# Altium schematic sheet Ext_PTT_and_Indication.SchDoc
size A3
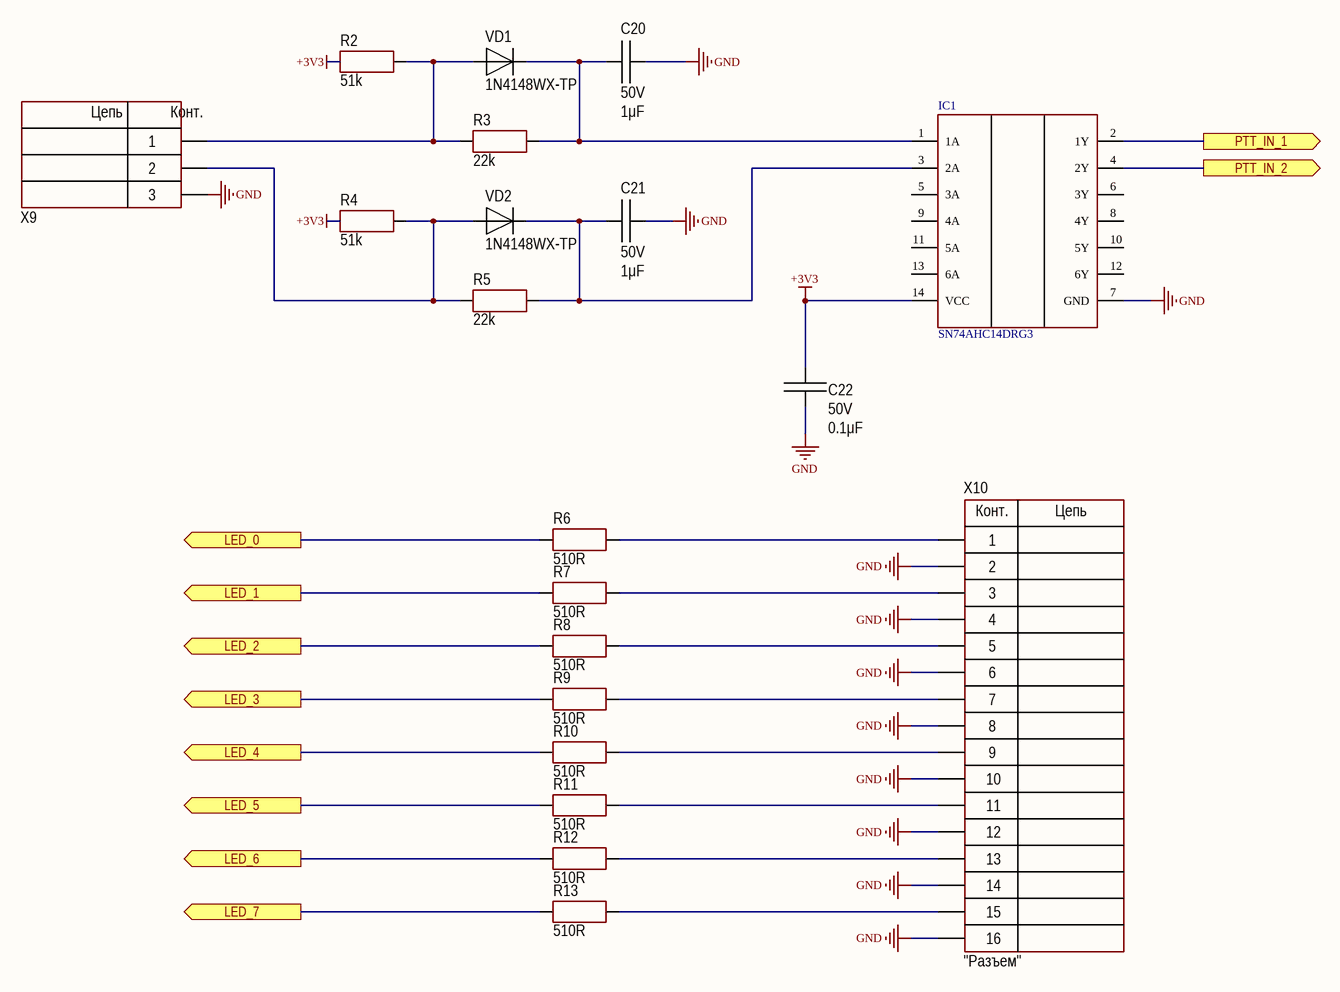
[diagram p0: Ext_PTT_and_Indication.SchDoc]

## Parts
C20  value 1μF  Voltage: 50V  [CAP: 1206]
C21  value 1μF  Voltage: 50V  [CAP: 1206]
C22  value 0.1μF  Voltage: 50V  [CAP: 1206]
IC1  SN74AHC14DRG3  [D0014A_N]
R2  value 51k  [RES: 1206]
R3  value 22k  [RES: 1206]
R4  value 51k  [RES: 1206]
R5  value 22k  [RES: 1206]
R6  value 510R  [RES: 1206]
R7  value 510R  [RES: 1206]
R8  value 510R  [RES: 1206]
R9  value 510R  [RES: 1206]
R10  value 510R  [RES: 1206]
R11  value 510R  [RES: 1206]
R12  value 510R  [RES: 1206]
R13  value 510R  [RES: 1206]
VD1  PartNumber: 1N4148WX-TP  [DIODE: SOD123]
VD2  PartNumber: 1N4148WX-TP  [DIODE: SOD123]
X9  (no value)  [2EDGR-5.08-03P]
X10  CommentText: "Разъем"  [CON: IDC-16MS]

## Ports
LED_0 (out), LED_1 (out), LED_2 (out), LED_3 (out), LED_4 (out), LED_5 (out), LED_6 (out), LED_7 (out), PTT_IN_1 (out), PTT_IN_2 (out)

## Nets
+3V3: C22.2 IC1.14(VCC) R2.2 R4.2
GND: C20.1 C21.1 C22.1 IC1.7(GND) X9.3 X10.2 X10.4 X10.6 X10.8 X10.10 X10.12 X10.14 X10.16
LED_0: R6.1 ; port LED_0
LED_1: R7.1 ; port LED_1
LED_2: R8.1 ; port LED_2
LED_3: R9.1 ; port LED_3
LED_4: R10.1 ; port LED_4
LED_5: R11.1 ; port LED_5
LED_6: R12.1 ; port LED_6
LED_7: R13.1 ; port LED_7
PTT_IN_1: IC1.2(1Y) ; port PTT_IN_1
PTT_IN_2: IC1.4(2Y) ; port PTT_IN_2
NetC20_2: C20.2 IC1.1(1A) R3.1 VD1.2
NetC21_2: C21.2 IC1.3(2A) R5.1 VD2.2
NetR2_1: R2.1 R3.2 VD1.1 X9.1
NetR4_1: R4.1 R5.2 VD2.1 X9.2
NetR6_2: R6.2 X10.1
NetR7_2: R7.2 X10.3
NetR8_2: R8.2 X10.5
NetR9_2: R9.2 X10.7
NetR10_2: R10.2 X10.9
NetR11_2: R11.2 X10.11
NetR12_2: R12.2 X10.13
NetR13_2: R13.2 X10.15

Not connected (* = marked no-connect by the designer): IC1 5(3A) 6(3Y) 8(4Y) 9(4A) 10(5Y) 11(5A) 12(6Y) 13(6A)

## Notes on the sheet
- (in symbol 2EDGR-5.08-03P) Цепь; Конт.
- (in symbol IDC-16) Конт.; Цепь

## Library data of the parts
C20 C21 = Ceramic_1206: Manufacturer: Yageo; PartNumber: CC1206KRX7R9BB104; ValueManufacturerPartNumber: Ceramic capacitor, 1μF, X7R, ±10%, 50V, 1206, -55...+125°C; TypeCapacitor: Ceramic capacitor; Tolerance: ±10%; TypeDielectric: X7R; Package: 1206; HelpURL: https://www.digikey.com/product-detail/en/yageo/CC1206KRX7R9BB104/311-1179-1-ND/303089; Temperature: -55...+125°C
C22 = Ceramic_1206: Manufacturer: Yageo; PartNumber: CC1206KRX7R9BB104; ValueManufacturerPartNumber: Ceramic capacitor, 0.1μF, X7R, ±10%, 50V, 1206, -55...+125°C; TypeCapacitor: Ceramic capacitor; Tolerance: ±10%; TypeDielectric: X7R; Package: 1206; HelpURL: https://www.digikey.com/product-detail/en/yageo/CC1206KRX7R9BB104/311-1179-1-ND/303089; Temperature: -55...+125°C
IC1 = SN74AHC14DRG3: Integrated Circuit; Manufacturer_Name: Nexperia; Manufacturer_Part_Number: 74HC14N,652; Arrow Part Number: 74HC14N,652; Arrow Price/Stock: https://www.arrow.com/en/products/74hc14n652/nexperia
R2-R13 = Resistor_1206: Manufacturer: Yageo; PartNumber: RC1206JR-07100RL; TypeResistor: Resistor film; Power: 0.25W; Package: 1206; HelpURL: https://www.digikey.com/product-detail/en/yageo/RC1206JR-07100RL/311-100ERCT-ND/732153; ValueManufacturerPartNumber: =TypeResistor+', '+Value+', '+Tolerance+', '+Package+', '+Power+', '+Temperature; Temperature: -55...+125°C
VD1 VD2 = Diode_single: Manufacturer: Micro Commercial; ValueManufacturerPartNumber: Single diode, 75V, 150mA, 1V, 4ns, SOD-323, -55...+150°C; TypeDiode: Single diode; Voltage: 75V; Current: 150mA; VoltageDrop: 1V; RecoveryTime: 4ns; Package: SOD-323; HelpURL: https://www.digikey.com/product-detail/en/micro-commercial-co/1N4148WX-TP/1N4148WXTPMSCT-ND/717312; Temperature: -55...+150°C
X9 = 2EDGR-5.08-03P: Manufacturer: Connfly; ValueManufacturerPartNumber: Connector, 6pin, 2.54mm, 500VAC, 3A; PartNumber: PBS-6; TypeConnector: Connector; VoltageMax: 500VAC; Pitch: 2.54mm; CurrentMax: 3A; Multichannel: 6pin; CommentText: "Разъем"; HelpURL: https://www.chipdip.ru/product/pbs-6
X10 = IDC-16: Manufacturer: Connfly; ValueManufacturerPartNumber: Connector, 16pin, 2.54mm, 250VAC, 3A; TypeConnector: Connector; VoltageMax: 250VAC; Pitch: 2.54mm; CurrentMax: 3A; Multichannel: 16pin; HelpURL: https://www.chipdip.ru/product/idc-16ms; PartNumber: IDC-16